# EAGLE schematic main (EAGLE 9.6.2)
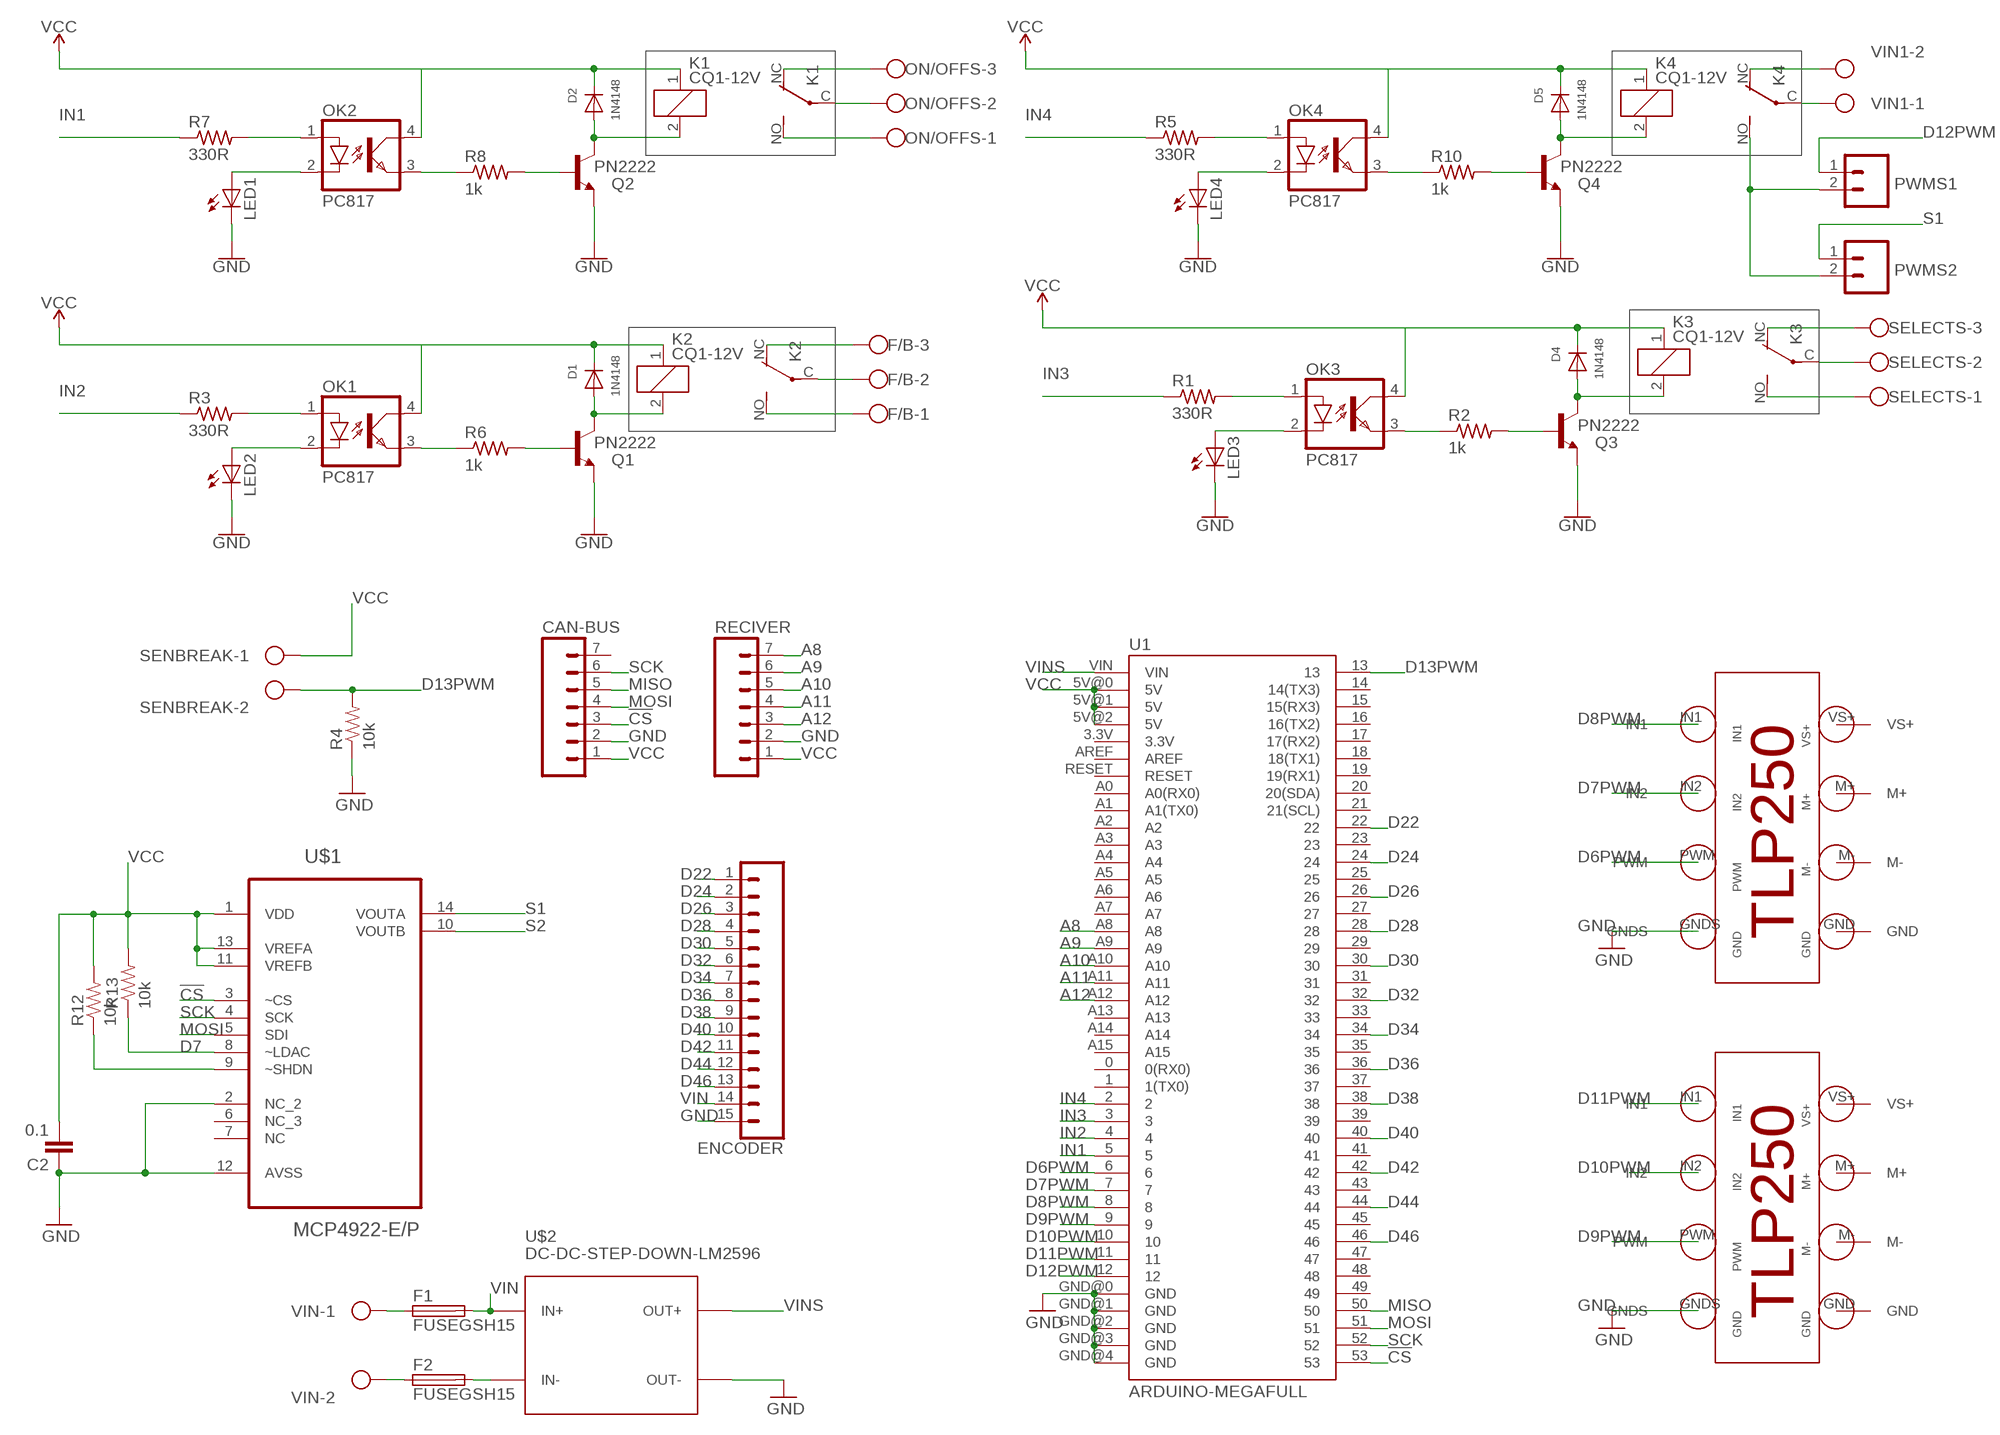
[diagram p0: schematic, sheet 1]

## Parts
C2  0.1  CAPPTH1  [CAP-PTH-5MM]
CAN-BUS  M07  [1X07]
D1  1N4148  DIODEDO-1N4148  [DO-1N4148]
D2  1N4148  DIODEDO-1N4148  [DO-1N4148]
D4  1N4148  DIODEDO-1N4148  [DO-1N4148]
D5  1N4148  DIODEDO-1N4148  [DO-1N4148]
ENCODER  CONN_15  [1X15]
F1  FUSEGSH15  [GSH15]
F2  FUSEGSH15  [GSH15]
F/B  W237-103  [W237-103]
K1  CQ1-12V  [CQ1]
K2  CQ1-12V  [CQ1]
K3  CQ1-12V  [CQ1]
K4  CQ1-12V  [CQ1]
LED1  LED3MM  [LED3MM]
LED2  LED3MM  [LED3MM]
LED3  LED3MM  [LED3MM]
LED4  LED3MM  [LED3MM]
OK1  PC817  [DIL04]
OK2  PC817  [DIL04]
OK3  PC817  [DIL04]
OK4  PC817  [DIL04]
ON/OFFS  W237-103  [W237-103]
PWMS1  Out1  M02PTH3  [1X02_LONGPADS]
PWMS2  Out1  M02PTH3  [1X02_LONGPADS]
Q1  PN2222  BC447  [TO92-EBC]
Q2  PN2222  BC447  [TO92-EBC]
Q3  PN2222  BC447  [TO92-EBC]
Q4  PN2222  BC447  [TO92-EBC]
R1  330R  R-US_0204/7  [0204/7]
R2  1k  R-US_0204/7  [0204/7]
R3  330R  R-US_0204/7  [0204/7]
R4  10k  RESISTORAXIAL-0.3  [AXIAL-0.3]
R5  330R  R-US_0204/7  [0204/7]
R6  1k  R-US_0204/7  [0204/7]
R7  330R  R-US_0204/7  [0204/7]
R8  1k  R-US_0204/7  [0204/7]
R10  1k  R-US_0204/7  [0204/7]
R12  10k  RESISTORAXIAL-0.3  [AXIAL-0.3]
R13  10k  RESISTORAXIAL-0.3  [AXIAL-0.3]
RECIVER  M07  [1X07]
SELECTS  W237-103  [W237-103]
SENBREAK  Vcc  W237-102  [W237-102]
U1  ARDUINO-MEGAFULL  [ARDUINO_MEGA]
U$1  MCP4922-E/P  [DIP254P762X533-14]
U$2  DC-DC-STEP-DOWN-LM2596  [DC-DC-STEP-DOWN-LM2596]
U$3  TLP250V1  [TLP250]
U$4  TLP250V1  [TLP250]
VIN  -  W237-102  [W237-102]
VIN1  -  W237-102  [W237-102]

## Nets
3: D4.A K3.2 Q3.C
6: D5.A K4.2 Q4.C
22: D2.A K1.2 Q2.C
!CS: CAN-BUS.3 U1.53 U$1.3(~CS)
!SHDN: R12.P$1 U$1.9(~SHDN)
A8: RECIVER.7 U1.A8
A9: RECIVER.6 U1.A9
A10: RECIVER.5 U1.A10
A11: RECIVER.4 U1.A11
A12: RECIVER.3 U1.A12
D6PWM: U1.6 U$3.PWM
D7: R13.P$1 U$1.8(~LDAC)
D7PWM: U1.7 U$3.IN2
D8PWM: U1.8 U$3.IN1
D9PWM: U1.9 U$4.PWM
D10PWM: U1.10 U$4.IN2
D11PWM: U1.11 U$4.IN1
D12PWM: PWMS1.1 U1.12
D13PWM: R4.P$2 SENBREAK.2 U1.13
D22: ENCODER.1 U1.22
D24: ENCODER.2 U1.24
D26: ENCODER.3 U1.26
D28: ENCODER.4 U1.28
D30: ENCODER.5 U1.30
D32: ENCODER.6 U1.32
D34: ENCODER.7 U1.34
D36: ENCODER.8 U1.36
D38: ENCODER.9 U1.38
D40: ENCODER.10 U1.40
D42: ENCODER.11 U1.42
D44: ENCODER.12 U1.44
D46: ENCODER.13 U1.46
GND: C2.1 CAN-BUS.2 ENCODER.15 LED1.K(C) LED2.K(C) LED3.K(C) LED4.K(C) Q1.E Q2.E Q3.E Q4.E R4.P$1 RECIVER.2 U1.GND@0(GND) U1.GND@1(GND) U1.GND@2(GND) U1.GND@3(GND) U1.GND@4(GND) U$1.2(NC_2) U$1.12(AVSS) U$2.OUT- U$3.GNDS U$4.GNDS
GND-: D1.A K2.2 Q1.C
IN1: R7.1 U1.5
IN2: R3.1 U1.4
IN3: R1.1 U1.3
IN4: R5.1 U1.2
INS: OK1.1(A) R3.2
INSS: OK2.1(A) R7.2
INSS1: OK3.1(A) R1.2
INSS2: OK4.1(A) R5.2
LED: LED2.A OK1.2(C)
LEDS: LED1.A OK2.2(C)
LEDS1: LED3.A OK3.2(C)
LEDS2: LED4.A OK4.2(C)
MISO: CAN-BUS.5 U1.50
MOSI: CAN-BUS.4 U1.51 U$1.5(SDI)
N$1: K4.NO(2:S) PWMS1.2 PWMS2.2
N$2: K1.NO(2:S) ON/OFFS.1
N$3: K1.C(2:P) ON/OFFS.2
N$4: F/B.1 K2.NO(2:S)
N$5: F/B.2 K2.C(2:P)
N$6: Q3.B R2.2
N$7: OK3.3(EMIT) R2.1
N$8: K3.NO(2:S) SELECTS.1
N$9: K3.C(2:P) SELECTS.2
N$10: Q4.B R10.2
N$11: OK4.3(EMIT) R10.1
N$12: Q1.B R6.2
N$14: K4.C(2:P) VIN1.1
N$15: K1.NC(2:O) ON/OFFS.3
N$16: F/B.3 K2.NC(2:O)
N$17: K3.NC(2:O) SELECTS.3
N$18: K4.NC(2:O) VIN1.2
N$20: Q2.B R8.2
N$22: OK2.3(EMIT) R8.1
N$24: F1.1 VIN.1
N$25: F2.2 U$2.IN-
N$26: F2.1 VIN.2
OTP: OK1.3(EMIT) R6.1
S1: PWMS2.1 U$1.14(VOUTA)
S2: U$1.10(VOUTB)
SCK: CAN-BUS.6 U1.52 U$1.4(SCK)
VCC: C2.2 CAN-BUS.1 D1.C D2.C D4.C D5.C K1.1 K2.1 K3.1 K4.1 OK1.4(COL) OK2.4(COL) OK3.4(COL) OK4.4(COL) R12.P$2 R13.P$2 RECIVER.1 SENBREAK.1 U1.5V@0(5V) U1.5V@1(5V) U1.5V@2(5V) U$1.1(VDD) U$1.11(VREFB) U$1.13(VREFA)
VIN: ENCODER.14 F1.2 U$2.IN+
VINS: U1.VIN U$2.OUT+
Unconnected: CAN-BUS.7 U1.0(0(RX0)) U1.1(1(TX0)) U1.3.3V U1.14(14(TX3)) U1.15(15(RX3)) U1.16(16(TX2)) U1.17(17(RX2)) U1.18(18(TX1)) U1.19(19(RX1)) U1.20(20(SDA)) U1.21(21(SCL)) U1.23 U1.25 U1.27 U1.29 U1.31 U1.33 U1.35 U1.37 U1.39 U1.41 U1.43 U1.45 U1.47 U1.48 U1.49 U1.A0(A0(RX0)) U1.A1(A1(TX0)) U1.A2 U1.A3 U1.A4 U1.A5 U1.A6 U1.A7 U1.A13 U1.A14 U1.A15 U1.AREF U1.RESET U$1.6(NC_3) U$1.7(NC) U$3.GND U$3.M+ U$3.M- U$3.VS+ U$4.GND U$4.M+ U$4.M- U$4.VS+

## Library data of the parts
C2 = SparkFun-Passives:CAP: Capacitor Standard 0603 ceramic capacitor, and 0.1" leaded capacitor.
CAN-BUS RECIVER = SparkFun:M07: Header 7 Standard 7-pin 0.1" header. Use with straight break away headers (SKU : PRT-00116), right angle break away headers (PRT-00553), swiss pins (PRT-00743), machine pins (PRT-00117), and female headers (PRT-00115). NOTES ON THE VARIANTS LOCK and LOCK_LONGPADS... This footprint was designed to help hold the alignment of a through-hole component (i.e. 7-pin header) while soldering it into place. You may notice that each hole has been shifted either up or down by 0.005 of an inch from it's more standard position (which is usually a perfectly straight line). This slight alteration caused the pins (the squares in the middle) to touch the edges of the holes. Because they are alternating, it causes a "brace" to hold the header in place. 0.005 has proven to be the perfect amount of "off-center" position when using our standard breakaway headers. Although looks a little odd when you look at the bare footprint, once you have a header in there, the alteration is very hard to notice. Also, if you push a header all the way into place, it is covered up entirely on the bottom side. This idea of altering the position of holes to aid alignment will be further integrated into the Sparkfun Library for other footprints. It can help hold any component with 3 or more connection pins.
D1 D2 D4 D5 = adafruit:DIODE: Diode SMADIODE - SMA Surface Mount Package 20V 1A Schottky Diode Digikey: 641-1014-6-ND DO-1N4148 - Through Hole Small Current Diode SOD-123 20V 1 A (.5mV Vf) Schottky Diode - Digikey: MBRX120TPMSCT-ND SOD-323 10V 570mA (.38mV Vf, 3ns) Schottky Diode - Digikey: ZLLS410CT-ND SOD-523 30V 30mA Schottky Diode (RB751S-40TE61) - Digikey: RB751S-40TE61CT-ND SOT23-R/W - SOT23 Package (R = Solder Paste/Reflow Ovens, W = Hand-Soldering) BAT54Film 40V 300mA - Digikey: 497-7162-1-ND
ENCODER = SparkFun-Connectors:CONN_15: Multi connection point. Often used as Generic Header-pin footprint for 0.1 inch spaced/style header connections On any of the 0.1 inch spaced packages, you can populate with these: Break Away Headers - Straight <https://www.sparkfun.com/products/116> (PRT-00116) Break Away Male Headers - Right Angle <https://www.sparkfun.com/products/553> (PRT-00553) Female Headers <https://www.sparkfun.com/products/115> (PRT-00115) Break Away Headers - Machine Pin <https://www.sparkfun.com/products/117> (PRT-00117) Break Away Female Headers - Swiss Machine Pin <https://www.sparkfun.com/products/743> (PRT-00743) For SCREWTERMINALS and SPRING TERMINALS visit here: Screw Terimnals on SparkFun.com <https://www.sparkfun.com/search/results?term=Screw+Terminals> (5mm/3.5mm/2.54mm spacing) This device is also useful as a general connection point to wire up your design to another part of your project. Our various solder wires solder well into these plated through hole pads. Hook-Up Wire - Assortment (Stranded, 22 AWG) <https://www.sparkfun.com/products/11375> (PRT-11375) Hook-Up Wire - Assortment (Solid Core, 22 AWG) <https://www.sparkfun.com/products/11367> (PRT-11367) View the entire wire category on our website here <https://www.sparkfun.com/categories/141> Special notes: Molex polarized connector foot print use with SKU : PRT-08231 with associated crimp pins and housings. 1MM SMD Version SKU: PRT-10208 NOTES ON THE VARIANTS LOCK and LOCK_LONGPADS... This footprint was designed to help hold the alignment of a through-hole component (i.e. 6-pin header) while soldering it into place. You may notice that each hole has been shifted either up or down by 0.005 of an inch from it's more standard position (which is a perfectly straight line). This slight alteration caused the pins (the squares in the middle) to touch the edges of the holes. Because they are alternating, it causes a "brace" to hold the component in place. 0.005 has proven to be the perfect amount of "off-center" position when using our standard breakaway headers. Although looks a little odd when you look at the bare footprint, once you have a header in there, the alteration is very hard to notice. Also,if you push a header all the way into place, it is covered up entirely on the bottom side.
F1 F2 = fuse:FUSE: Fuse; OC_FARNELL: unknown; OC_NEWARK: unknown
F/B ON/OFFS SELECTS = con-wago-500:W237-103: WAGO SCREW CLAMP; MPN: 237-103; OC_FARNELL: unknown; OC_NEWARK: 18M7116
K1-K4 = relay5vdc:CQ1-12V: AUTOMOTIVE QUIET RELAY NAiS Source: http://www.mew-europe.com/.. en_ds_61208_0000.pdf; OC_FARNELL: unknown; OC_NEWARK: unknown
LED1-LED4 = adafruit:LED: LED OSRAM: - CHIPLED LG R971, LG N971, LY N971, LG Q971, LY Q971, LO R971, LY R971 LH N974, LH R974 LS Q976, LO Q976, LY Q976 LO Q996 - Hyper CHIPLED LW Q18S LB Q993, LB Q99A, LB R99A - SideLED LS A670, LO A670, LY A670, LG A670, LP A670 LB A673, LV A673, LT A673, LW A673 LH A674 LY A675 LS A676, LA A676, LO A676, LY A676, LW A676 LS A679, LY A679, LG A679 - Hyper Micro SIDELED® LS Y876, LA Y876, LO Y876, LY Y876 LT Y87S - SmartLED LW L88C, LW L88S LB L89C, LB L89S, LG L890 LS L89K, LO L89K, LY L89K LS L896, LA L896, LO L896, LY L896 - TOPLED LS T670, LO T670, LY T670, LG T670, LP T670 LSG T670, LSP T670, LSY T670, LOP T670, LYG T670 LG T671, LOG T671, LSG T671 LB T673, LV T673, LT T673, LW T673 LH T674 LS T676, LA T676, LO T676, LY T676, LB T676, LH T676, LSB T676, LW T676 LB T67C, LV T67C, LT T67C, LS T67K, LO T67K, LY T67K, LW E67C LS E67B, LA E67B, LO E67B, LY E67B, LB E67C, LV E67C, LT E67C LW T67C LS T679, LY T679, LG T679 LS T770, LO T770, LY T770, LG T770, LP T770 LB T773, LV T773, LT T773, LW T773 LH T774 LS E675, LA E675, LY E675, LS T675 LS T776, LA T776, LO T776, LY T776, LB T776 LHGB T686 LT T68C, LB T68C - Hyper Mini TOPLED® LB M676 - Mini TOPLED Santana® LG M470 LS M47K, LO M47K, LY M47K Source: http://www.osram.convergy.de/
OK1-OK4 = optocoupler:PC817: SHARP OPTO COUPLER; MPN: PC817X4J000F; OC_FARNELL: 9707727; OC_NEWARK: 97K7059
PWMS1 PWMS2 = SparkFun-Connectors:M02: Standard 2-pin 0.1" header. Use with - straight break away headers ( PRT-00116) - right angle break away headers (PRT-00553) - swiss pins (PRT-00743) - machine pins (PRT-00117) - female headers (PRT-00115) Molex polarized connector foot print use with: PRT-08233 with associated crimp pins and housings. 2.54_SCREWTERM for use with PRT-10571. 3.5mm Screw Terminal footprints for PRT-08084 5mm Screw Terminal footprints for use with PRT-08432
Q1-Q4 = transistor-npn:BC447*: NPN Transistor
R1-R3 R5-R8 R10 = adafruit:R-US_: RESISTOR, American symbol
R4 R12 R13 = SparkFun-Passives:RESISTOR: Resistor Basic schematic elements and footprints for 0603, 1206, and PTH resistors.
SENBREAK VIN VIN1 = con-wago-500:W237-102: WAGO SCREW CLAMP; MPN: 237-102; OC_FARNELL: unknown; OC_NEWARK: 70K9898
U1 = SparkFun-Boards:ARDUINO-MEGA: Arduino Mega board footprint
U$1 = Microchip_By_element14_Batch_1:MCP4922-E/P: 12-Bit DAC; MPN: MCP4922-E/P; OC_FARNELL: 1292244; OC_NEWARK: 61K2950; PACKAGE: DIP-14; SUPPLIER: Microchip
U$2 = diy-modules:DC-DC-STEP-DOWN-LM2596: DC/DC Step-Down Regulator based on LM2596-ADJ chip LM2596 datasheet available here: http://www.ti.com/lit/ds/symlink/lm2596.pdf Click here to find device on ebay.com <http://www.ebay.com/sch/lm2596+power+regulator>
U$3 U$4 = TLP250:TLP250V1